# EAGLE schematic display_v2 (EAGLE 5.10)
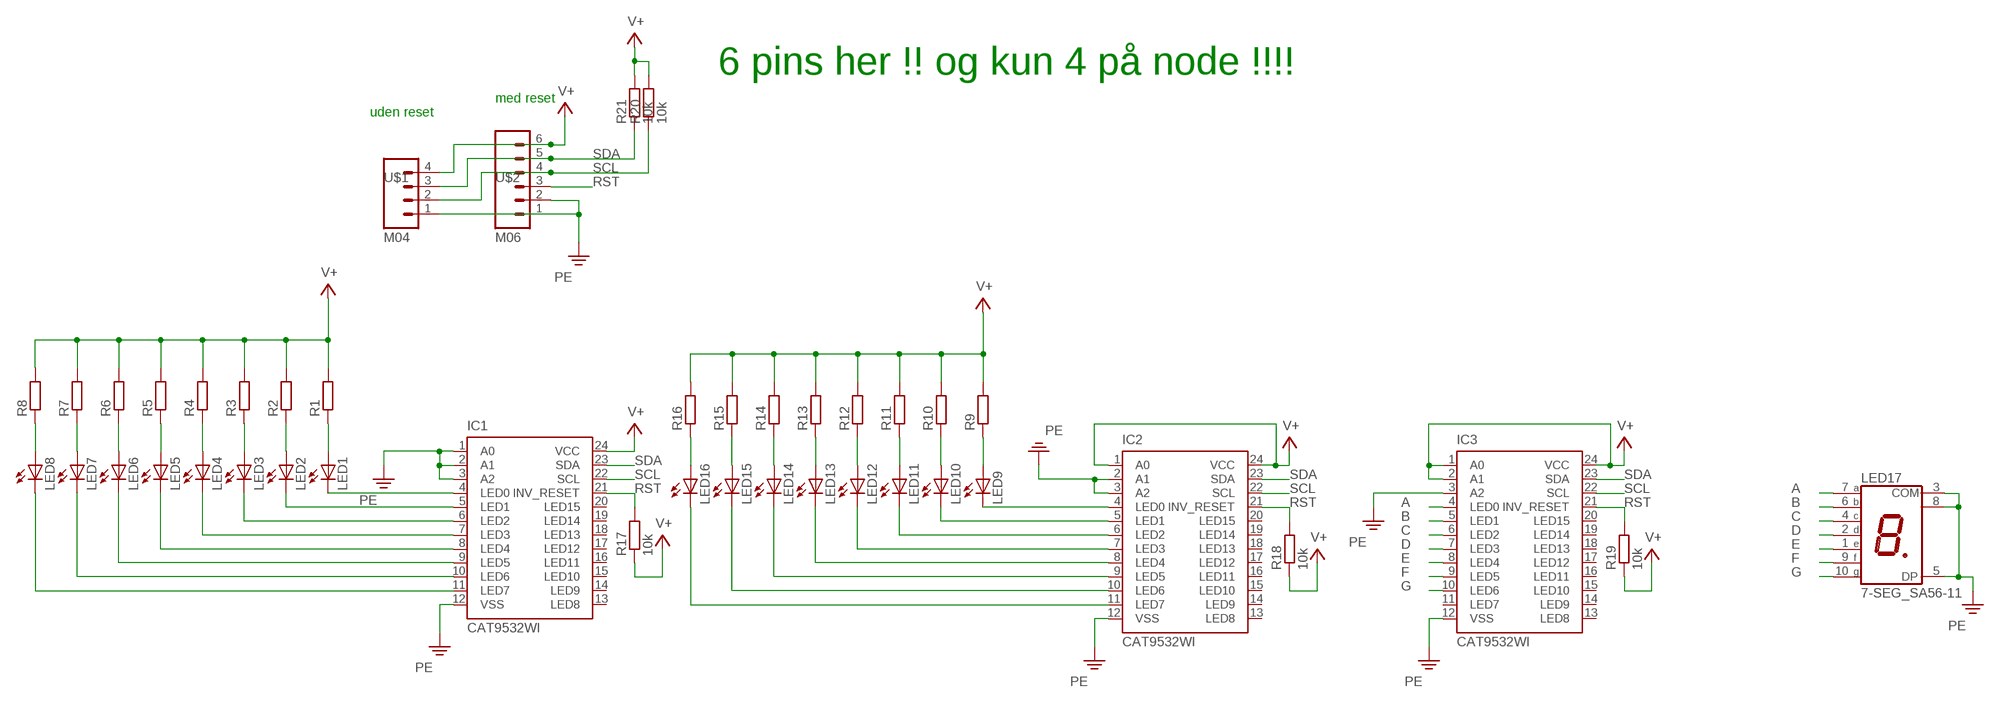
[diagram p0: schematic, sheet 1]

## Parts
IC1  CAT9532WI  [24SOIT]
IC2  CAT9532WI  [24SOIT]
IC3  CAT9532WI  [24SOIT]
LED1  LEDCHIPLED_1206  [CHIPLED_1206]
LED2  LEDCHIPLED_1206  [CHIPLED_1206]
LED3  LEDCHIPLED_1206  [CHIPLED_1206]
LED4  LEDCHIPLED_1206  [CHIPLED_1206]
LED5  LEDCHIPLED_1206  [CHIPLED_1206]
LED6  LEDCHIPLED_1206  [CHIPLED_1206]
LED7  LEDCHIPLED_1206  [CHIPLED_1206]
LED8  LEDCHIPLED_1206  [CHIPLED_1206]
LED9  LEDCHIPLED_1206  [CHIPLED_1206]
LED10  LEDCHIPLED_1206  [CHIPLED_1206]
LED11  LEDCHIPLED_1206  [CHIPLED_1206]
LED12  LEDCHIPLED_1206  [CHIPLED_1206]
LED13  LEDCHIPLED_1206  [CHIPLED_1206]
LED14  LEDCHIPLED_1206  [CHIPLED_1206]
LED15  LEDCHIPLED_1206  [CHIPLED_1206]
LED16  LEDCHIPLED_1206  [CHIPLED_1206]
LED17  7-SEG_SA56-11  [SA56-11]
R1  R-EU_R0805  [R0805]
R2  R-EU_R0805  [R0805]
R3  R-EU_R0805  [R0805]
R4  R-EU_R0805  [R0805]
R5  R-EU_R0805  [R0805]
R6  R-EU_R0805  [R0805]
R7  R-EU_R0805  [R0805]
R8  R-EU_R0805  [R0805]
R9  R-EU_R0805  [R0805]
R10  R-EU_R0805  [R0805]
R11  R-EU_R0805  [R0805]
R12  R-EU_R0805  [R0805]
R13  R-EU_R0805  [R0805]
R14  R-EU_R0805  [R0805]
R15  R-EU_R0805  [R0805]
R16  R-EU_R0805  [R0805]
R17  10k  R-EU_R0805  [R0805]
R18  10k  R-EU_R0805  [R0805]
R19  10k  R-EU_R0805  [R0805]
R20  10k  R-EU_R0805  [R0805]
R21  10k  R-EU_R0805  [R0805]
U$1  M04  [S4B-PH]
U$2  M06  [S6B_PH]

## Nets
A: IC3.4(LED0) LED17.7(A)
B: IC3.5(LED1) LED17.6(B)
C: IC3.6(LED2) LED17.4(C)
D: IC3.7(LED3) LED17.2(D)
E: IC3.8(LED4) LED17.1(E)
F: IC3.9(LED5) LED17.9(F)
G: IC3.10(LED6) LED17.10(G)
N$1: IC1.4(LED0) LED1.C
N$3: IC1.5(LED1) LED2.C
N$4: IC1.6(LED2) LED3.C
N$5: IC1.7(LED3) LED4.C
N$6: IC1.8(LED4) LED5.C
N$7: IC1.9(LED5) LED6.C
N$8: IC1.10(LED6) LED7.C
N$9: IC1.11(LED7) LED8.C
N$11: LED1.A R1.1
N$12: LED2.A R2.1
N$13: LED3.A R3.1
N$14: LED4.A R4.1
N$15: LED5.A R5.1
N$16: LED6.A R6.1
N$17: LED7.A R7.1
N$18: LED8.A R8.1
N$19: IC2.4(LED0) LED9.C
N$20: IC2.5(LED1) LED10.C
N$21: IC2.6(LED2) LED11.C
N$22: IC2.7(LED3) LED12.C
N$23: IC2.8(LED4) LED13.C
N$24: IC2.9(LED5) LED14.C
N$25: IC2.10(LED6) LED15.C
N$26: IC2.11(LED7) LED16.C
N$27: LED9.A R9.1
N$28: LED10.A R10.1
N$29: LED11.A R11.1
N$30: LED12.A R12.1
N$31: LED13.A R13.1
N$32: LED14.A R14.1
N$33: LED15.A R15.1
N$34: LED16.A R16.1
PE: IC1.1(A0) IC1.2(A1) IC1.3(A2) IC1.12(VSS) IC2.2(A1) IC2.3(A2) IC2.12(VSS) LED17.3(COM) LED17.5(DP) LED17.8(COM) U$1.1 U$2.2
RST: IC1.21(INV_RESET) IC2.21(INV_RESET) R17.2 R18.2 R19.2 U$2.3
SCL: IC1.22(SCL) IC2.22(SCL) IC3.22(SCL) R20.1 U$1.2 U$2.4
SDA: IC1.23(SDA) IC2.23(SDA) IC3.23(SDA) R21.1 U$1.3 U$2.5
V+: IC1.24(VCC) IC2.1(A0) IC2.24(VCC) IC3.1(A0) IC3.2(A1) IC3.24(VCC) R1.2 R2.2 R3.2 R4.2 R5.2 R6.2 R7.2 R8.2 R9.2 R10.2 R11.2 R12.2 R13.2 R14.2 R15.2 R16.2 R17.1 R18.1 R19.1 R20.2 R21.2 U$1.4 U$2.6
Unconnected: IC1.13(LED8) IC1.14(LED9) IC1.15(LED10) IC1.16(LED11) IC1.17(LED12) IC1.18(LED13) IC1.19(LED14) IC1.20(LED15) IC2.13(LED8) IC2.14(LED9) IC2.15(LED10) IC2.16(LED11) IC2.17(LED12) IC2.18(LED13) IC2.19(LED14) IC2.20(LED15) IC3.3(A2) IC3.11(LED7) IC3.12(VSS) IC3.13(LED8) IC3.14(LED9) IC3.15(LED10) IC3.16(LED11) IC3.17(LED12) IC3.18(LED13) IC3.19(LED14) IC3.20(LED15) IC3.21(INV_RESET) U$2.1

## Notes on the sheet
- 6 pins her !! og kun 4 på node !!!!
- med reset
- uden reset

## Library data of the parts
IC1-IC3 = unicorn_v2:CAT9532WI: Encoder to Counter Interface Source: http://www.usdigital.com/products/ls7183-ls7184/ls7183 ls7184 Data Sheet.pdf
LED1-LED16 = led:LED: LED OSRAM: - CHIPLED LG R971, LG N971, LY N971, LG Q971, LY Q971, LO R971, LY R971 LH N974, LH R974 LS Q976, LO Q976, LY Q976 LO Q996 - Hyper CHIPLED LW Q18S LB Q993, LB Q99A, LB R99A - SideLED LS A670, LO A670, LY A670, LG A670, LP A670 LB A673, LV A673, LT A673, LW A673 LH A674 LY A675 LS A676, LA A676, LO A676, LY A676, LW A676 LS A679, LY A679, LG A679 - Hyper Micro SIDELED® LS Y876, LA Y876, LO Y876, LY Y876 LT Y87S - SmartLED LW L88C, LW L88S LB L89C, LB L89S, LG L890 LS L89K, LO L89K, LY L89K LS L896, LA L896, LO L896, LY L896 - TOPLED LS T670, LO T670, LY T670, LG T670, LP T670 LSG T670, LSP T670, LSY T670, LOP T670, LYG T670 LG T671, LOG T671, LSG T671 LB T673, LV T673, LT T673, LW T673 LH T674 LS T676, LA T676, LO T676, LY T676, LB T676, LH T676, LSB T676, LW T676 LB T67C, LV T67C, LT T67C, LS T67K, LO T67K, LY T67K, LW E67C LS E67B, LA E67B, LO E67B, LY E67B, LB E67C, LV E67C, LT E67C LW T67C LS T679, LY T679, LG T679 LS T770, LO T770, LY T770, LG T770, LP T770 LB T773, LV T773, LT T773, LW T773 LH T774 LS E675, LA E675, LY E675, LS T675 LS T776, LA T776, LO T776, LY T776, LB T776 LHGB T686 LT T68C, LB T68C - Hyper Mini TOPLED® LB M676 - Mini TOPLED Santana® LG M470 LS M47K, LO M47K, LY M47K Source: http://www.osram.convergy.de LUXEON: - LUMILED® LXK2-PW12-R00, LXK2-PW12-S00, LXK2-PW14-U00, LXK2-PW14-V00 LXK2-PM12-R00, LXK2-PM12-S00, LXK2-PM14-U00 LXK2-PE12-Q00, LXK2-PE12-R00, LXK2-PE12-S00, LXK2-PE14-T00, LXK2-PE14-U00 LXK2-PB12-K00, LXK2-PB12-L00, LXK2-PB12-M00, LXK2-PB14-N00, LXK2-PB14-P00, LXK2-PB14-Q00 LXK2-PR12-L00, LXK2-PR12-M00, LXK2-PR14-Q00, LXK2-PR14-R00 LXK2-PD12-Q00, LXK2-PD12-R00, LXK2-PD12-S00 LXK2-PH12-R00, LXK2-PH12-S00 LXK2-PL12-P00, LXK2-PL12-Q00, LXK2-PL12-R00 Source: www.luxeon.com KINGBRIGHT: KA-3528ASYC Source: www.kingbright.com
LED17 = display-kingbright:7-SEG_: Kingbright 14.2mm (0.56 INCH) SINGLE DIGIT NUMERIC DUISPLAY Source: SA56-11EWA(Ver1189471036.pdf
R1-R21 = rcl:R-EU_: RESISTOR, European symbol
U$1 = unicorn_v2:M04
U$2 = unicorn_v2:M06